# Altium schematic sheet Codec.SchDoc
size A4; SheetNumber: 6; SheetTotal: 7
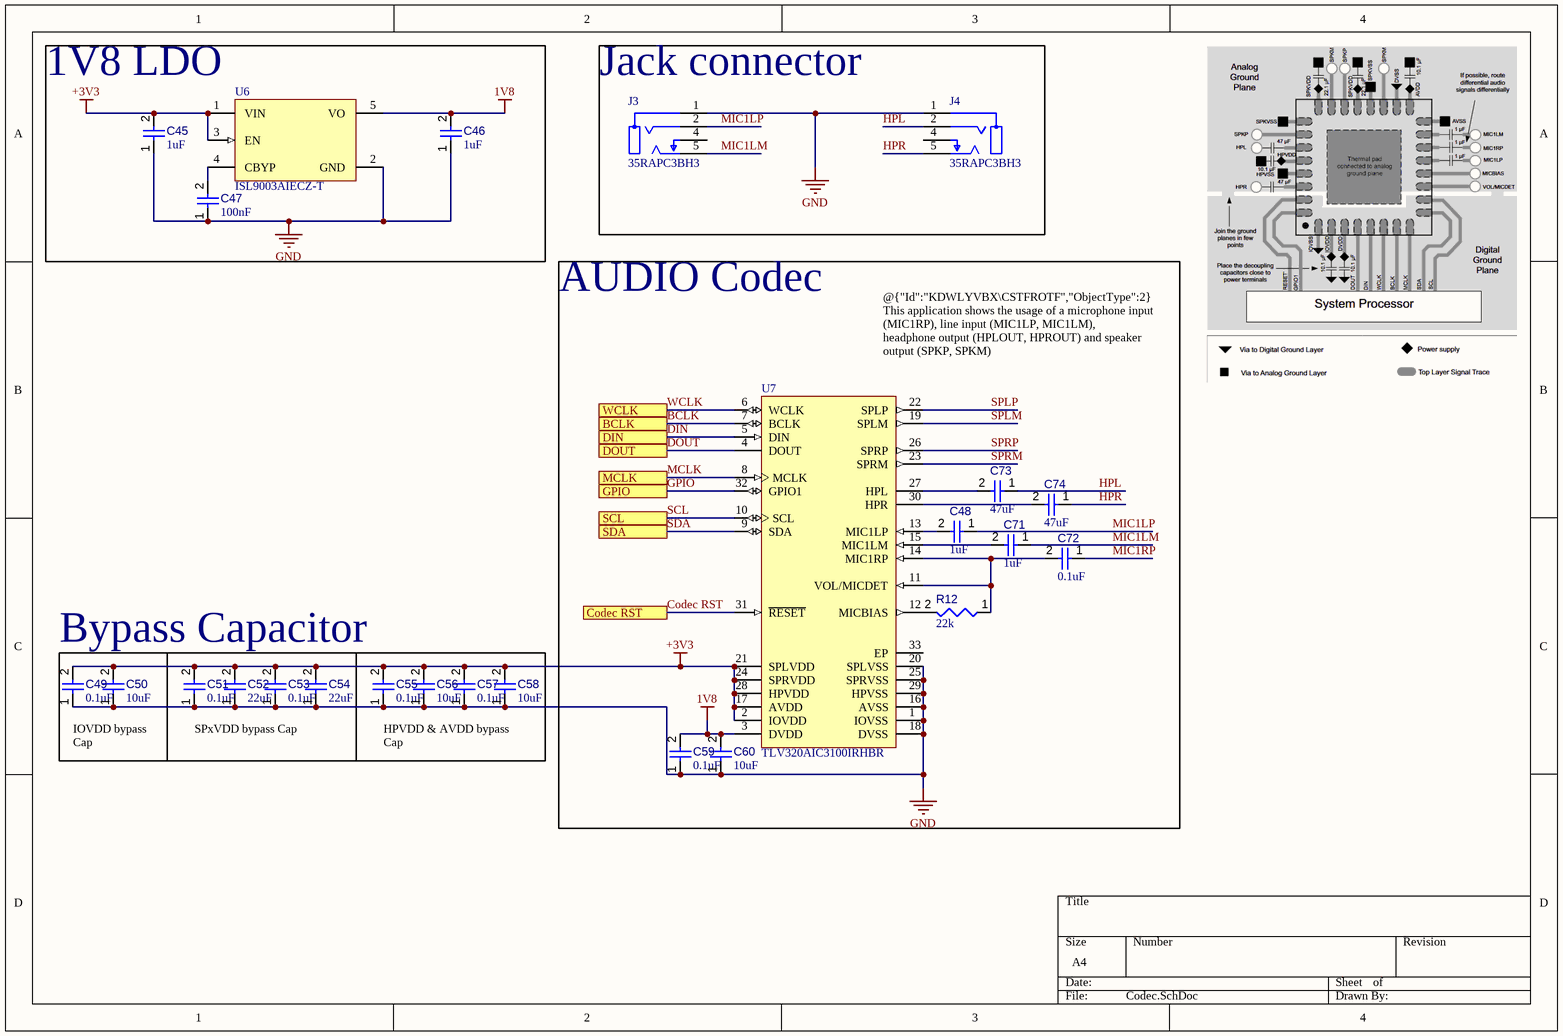
[diagram p0: Codec.SchDoc]

## Parts
C45  value 1uF  [CAPC0603(1608)100_L]  (hidden comment: Capacitor 470nF +/-20% 25V 0603)
C46  value 1uF  [CAPC0603(1608)100_L]  (hidden comment: Capacitor 470nF +/-20% 25V 0603)
C47  value 100nF  [CAPC0603(1608)100_L]  (hidden comment: Capacitor 470nF +/-20% 25V 0603)
C48  value 1uF  [CAPC0603(1608)100_L]  (hidden comment: Capacitor 470nF +/-20% 25V 0603)
C49  value 0.1uF  [CAPC0603(1608)100_L]  (hidden comment: Capacitor 470nF +/-20% 25V 0603)
C50  value 10uF  [CAPC0603(1608)100_L]  (hidden comment: Capacitor 470nF +/-20% 25V 0603)
C51  value 0.1uF  [CAPC0603(1608)100_L]  (hidden comment: Capacitor 470nF +/-20% 25V 0603)
C52  value 22uF  [CAPC0603(1608)100_L]  (hidden comment: Capacitor 470nF +/-20% 25V 0603)
C53  value 0.1uF  [CAPC0603(1608)100_L]  (hidden comment: Capacitor 470nF +/-20% 25V 0603)
C54  value 22uF  [CAPC0603(1608)100_L]  (hidden comment: Capacitor 470nF +/-20% 25V 0603)
C55  value 0.1uF  [CAPC0603(1608)100_L]  (hidden comment: Capacitor 470nF +/-20% 25V 0603)
C56  value 10uF  [CAPC0603(1608)100_L]  (hidden comment: Capacitor 470nF +/-20% 25V 0603)
C57  value 0.1uF  [CAPC0603(1608)100_L]  (hidden comment: Capacitor 470nF +/-20% 25V 0603)
C58  value 10uF  [CAPC0603(1608)100_L]  (hidden comment: Capacitor 470nF +/-20% 25V 0603)
C59  value 0.1uF  [CAPC0603(1608)100_L]  (hidden comment: Capacitor 470nF +/-20% 25V 0603)
C60  value 10uF  [CAPC0603(1608)100_L]  (hidden comment: Capacitor 470nF +/-20% 25V 0603)
C71  value 1uF  [CAPC0603(1608)100_L]  (hidden comment: Capacitor 470nF +/-20% 25V 0603)
C72  value 0.1uF  [CAPC0603(1608)100_L]  (hidden comment: Capacitor 470nF +/-20% 25V 0603)
C73  value 47uF  [CAPC0603(1608)100_L]  (hidden comment: Capacitor 470nF +/-20% 25V 0603)
C74  value 47uF  [CAPC0603(1608)100_L]  (hidden comment: Capacitor 470nF +/-20% 25V 0603)
J3  35RAPC3BH3  [FP-35RAPC3BH3-MFG]
J4  35RAPC3BH3  [FP-35RAPC3BH3-MFG]
R12  value 22k  [RESC0603(1608)_L]  (hidden comment: 120R3J)
U6  ISL9003AIECZ-T  [P5_049_MFG]
U7  TLV320AIC3100IRHBR  [RHB0032E_V]

## Blocks framed on the sheet
Jack connector: J3 J4
AUDIO Codec: C48 C59 C60 C71-C74 R12 U7
Bypass Capacitor: C49 C50

## Ports
BCLK, Codec RST, DIN, DOUT, GPIO, MCLK, SCL, SDA, WCLK

## Nets
1V8: C46.2 C59.2 C60.2 U6.5(VO) U7.3(DVDD)
+3V3: C45.2 C49.2 C50.2 C51.2 C52.2 C53.2 C54.2 C55.2 C56.2 C57.2 C58.2 U6.1(VIN) U6.3(EN) U7.2(IOVDD) U7.17(AVDD) U7.21(SPLVDD) U7.24(SPRVDD) U7.28(HPVDD)
GND: C45.1 C46.1 C47.1 C49.1 C50.1 C51.1 C52.1 C53.1 C54.1 C55.1 C56.1 C57.1 C58.1 C59.1 C60.1 J3.1 J4.1 U6.2(GND) U7.1(IOVSS) U7.16(AVSS) U7.18(DVSS) U7.20(SPLVSS) U7.25(SPRVSS) U7.29(HPVSS)
BCLK: U7.7(BCLK) ; port BCLK
Codec RST: U7.31(~{RESET}) ; port Codec RST
DIN: U7.5(DIN) ; port DIN
DOUT: U7.4(DOUT) ; port DOUT
GPIO: U7.32(GPIO1) ; port GPIO
HPL: C73.1 J4.2
HPR: C74.1 J4.5
MCLK: U7.8(MCLK) ; port MCLK
MIC1LM: C71.1 J3.5
MIC1LP: C48.1 J3.2
MIC1RP: C72.1
SCL: U7.10(SCL) ; port SCL
SDA: U7.9(SDA) ; port SDA
SPLM: U7.19(SPLM)
SPLP: U7.22(SPLP)
SPRM: U7.23(SPRM)
SPRP: U7.26(SPRP)
WCLK: U7.6(WCLK) ; port WCLK
NetC47_2: C47.2 U6.4(CBYP)
NetC48_2: C48.2 U7.13(MIC1LP)
NetC71_2: C71.2 U7.15(MIC1LM)
NetC72_2: C72.2 R12.1 U7.11(VOL/MICDET) U7.14(MIC1RP)
NetC73_2: C73.2 U7.27(HPL)
NetC74_2: C74.2 U7.30(HPR)
NetR12_2: R12.2 U7.12(MICBIAS)

Not connected (* = marked no-connect by the designer): J3 4; J4 4; U7 33(EP)

## Notes on the sheet
- 1V8 LDO
- (near U7) @{"Id":"KDWLYVBX\CSTFROTF","ObjectType":2} This application shows the usage of a microphone input (MIC1RP), line input (MIC1LP, MIC1LM),
  headphone output (HPLOUT, HPROUT) and speaker output (SPKP, SPKM)
- IOVDD bypass Cap
- SPxVDD bypass Cap
- HPVDD & AVDD bypass Cap

## Library data of the parts
C45-C60 C71-C74 = CMP-001-00077-3: Chip Capacitor, 470nF +/-20%, 25V, 0603, Thickness 1 mm; Tolerance: 10%; Max Operating Temperature: 85°C; Voltage Rating: 25V; Pins: 2; Case/Package: 0603; Mounting Technology: SMT; Min Operating Temperature: -55°C
J3 J4 = CMP-47983-000003-1: CONN JACK STEREO 3.5MM R/A; Gender: Female; Number of Positions: 3; Body Color: Black; Number of Ports: 1; Voltage Rating: 500V; Shielding: Unshielded; Body Material: Brass; Orientation: Right Angle; RoHS Compliant: Yes; Termination: Solder; Lead Free: Lead Free; Package Quantity: 1; Series: 35; Housing Material: PBT; Color: Black; Packaging: Bulk; Contact Plating: Silver; Mount: Through Hole; Contact Material: Copper Alloy; Number of Terminals/Pins: 3
R12 = CMP-009-00069-2: 120R 0.1W 5% 0603 (1608 Metric)  SMD; Power: 100mW; Mounting Technology: SMT; Tolerance: 5%; Case/Package: 0603; Pins: 2
U6 = CMP-00572-88255987-3: Active Positive GULL WING Not Qualified Linear Voltage Regulator IC 90dB 85C 150mA 2mm; Manufacturer Lifecycle Status: LAST TIME BUY; Accuracy: 0.8%; Min Current Limit: 175mA; Pitch: 700µm; Min Supply Voltage: 2.3V; Quiescent Current: 31µA; Dropout Voltage: 200mV; Number of Outputs: 1; Reference Voltage: 1V; Max Supply Voltage: 6.5V; Output Voltage: 1.8V; RAM Size: 512kB; Output Type: Fixed; ComponentLink3Description: Manufacturer's Package Drawing; Power Supply Rejection Ratio (PSRR): 90dB; ComponentLink3URL: https://www.renesas.com/en/document/psc/package-drawing-sc70-5pin-p5049; Max Operating Temperature: 85°C; Width: 1.2mm; Max Output Current: 150mA; Number of Pins: 5; Case/Package: SC; HelpURL: https://octopart.com/cad-content/api/get-model-datasheet/15189/88255987; ComponentLink2URL: https://octopart.com/cad-content/api/get-model-datasheet/15189/88255987; RoHS: Compliant; ComponentLink1URL: http://www.renesas.com; Length: 2mm; Lifecycle Status: EOL; Height: 1.1mm; Min Operating Temperature: -40°C; Polarity: Positive; ComponentLink1Description: Manufacturer's Website; Output Current: 150mA; Export Control Classification Number (ECCN) Code: EAR99; Min Input Voltage: 2.3V; Number of Regulators: 1; Max Input Voltage: 6.5V; ComponentLink2Description: Datasheet URL; Mount: Surface Mount
U7 = CMP-0331-00081-2: Low-Power Audio CODEC with Audio Processing and Mono Class-D Amplifier, 1 ADC and 2 DACs, 95 dB DAC SNR, -40 to 85 degC, 32-pin QFN (RHB), Green (RoHS & no Sb/Br); Manufacturer: Texas Instruments; Battery Powered: TRUE; Sampling Rate (Max) (kHz): 192; Digital Audio Interfaces: L, R, I2S, TDM, DSP; # ADCs (typ): 1; # DACs: 2; Control Interface: I2C; Additional Features: PLL, Mono Class-D Speaker Amplifier, Digital Mic Support; DAC SNR: 95; Speaker Amp Output Power(Max)(W): 2.5; PackageReference: RHB0032E; PackageDescription: 32-Pin Plastic Quad Flat No-Lead, 5 x 5 mm Body, 0.5 mm Pitch, 3.45 x 3.45 mm Exposed Pad; ComponentLink1URL: http://www.ti.com/general/docs/lit/getliterature.tsp?genericPartNumber=TLV320AIC3100&fileType=pdf; Code_JEDEC: MO-220; PartNumber: TLV320AIC3100IRHBR; DatasheetVersion: SLAS667A; Speaker Amp Type: Class-D; Headphone Driver: TRUE; ComponentLink1Description: Datasheet; PackageVersion: revD, Jun-2011; Speaker Amp Ouputs: 1; Mounting Technology: Surface Mount